# Altium schematic sheet FPGA-Power.SchDoc: ZoM Mod A - FPGA Power
size A4; Organization: Trenz Electronic GmbH / TT; DocumentNumber: 12; Revision: 01; SheetNumber: 12; SheetTotal: 13; Date: 12/16/2014
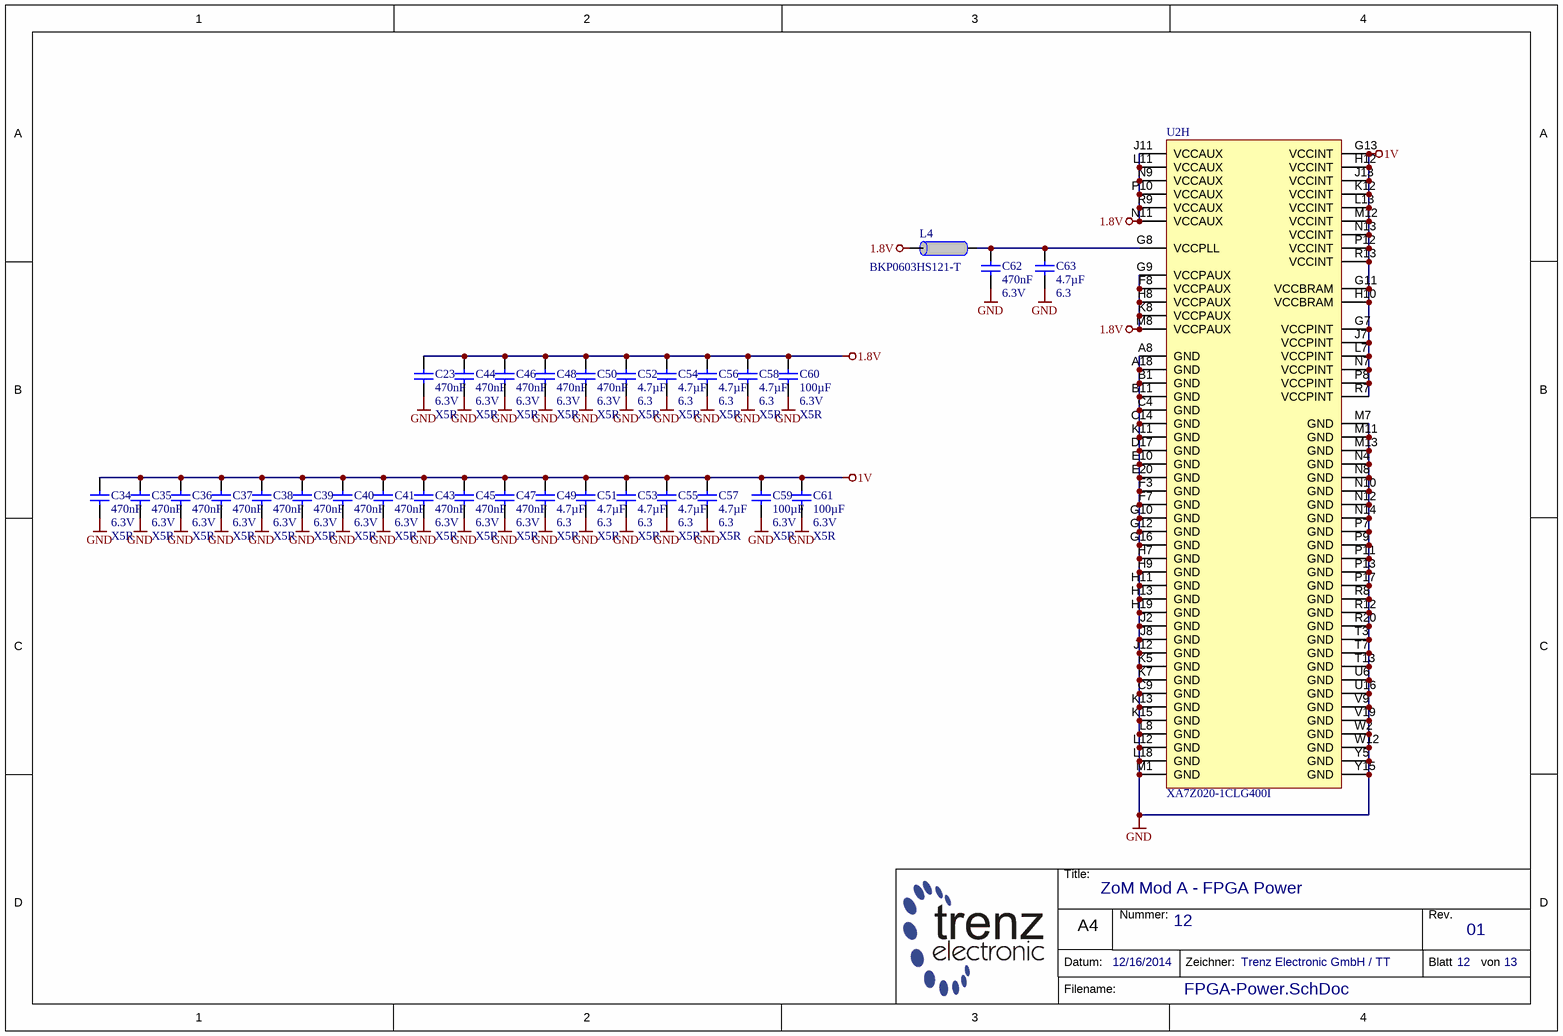
[diagram p0: FPGA-Power.SchDoc]

## Parts
C23  470nF  Voltage: 6.3V  Technology: X5R  [CAPC0603X33N]
C34  470nF  Voltage: 6.3V  Technology: X5R  [CAPC0603X33N]
C35  470nF  Voltage: 6.3V  Technology: X5R  [CAPC0603X33N]
C36  470nF  Voltage: 6.3V  Technology: X5R  [CAPC0603X33N]
C37  470nF  Voltage: 6.3V  Technology: X5R  [CAPC0603X33N]
C38  470nF  Voltage: 6.3V  Technology: X5R  [CAPC0603X33N]
C39  470nF  Voltage: 6.3V  Technology: X5R  [CAPC0603X33N]
C40  470nF  Voltage: 6.3V  Technology: X5R  [CAPC0603X33N]
C41  470nF  Voltage: 6.3V  Technology: X5R  [CAPC0603X33N]
C43  470nF  Voltage: 6.3V  Technology: X5R  [CAPC0603X33N]
C44  470nF  Voltage: 6.3V  Technology: X5R  [CAPC0603X33N]
C45  470nF  Voltage: 6.3V  Technology: X5R  [CAPC0603X33N]
C46  470nF  Voltage: 6.3V  Technology: X5R  [CAPC0603X33N]
C47  470nF  Voltage: 6.3V  Technology: X5R  [CAPC0603X33N]
C48  470nF  Voltage: 6.3V  Technology: X5R  [CAPC0603X33N]
C49  4.7µF  Voltage: 6.3  Technology: X5R  [CAPC1005X60N]
C50  470nF  Voltage: 6.3V  Technology: X5R  [CAPC0603X33N]
C51  4.7µF  Voltage: 6.3  Technology: X5R  [CAPC1005X60N]
C52  4.7µF  Voltage: 6.3  Technology: X5R  [CAPC1005X60N]
C53  4.7µF  Voltage: 6.3  Technology: X5R  [CAPC1005X60N]
C54  4.7µF  Voltage: 6.3  Technology: X5R  [CAPC1005X60N]
C55  4.7µF  Voltage: 6.3  Technology: X5R  [CAPC1005X60N]
C56  4.7µF  Voltage: 6.3  Technology: X5R  [CAPC1005X60N]
C57  4.7µF  Voltage: 6.3  Technology: X5R  [CAPC1005X60N]
C58  4.7µF  Voltage: 6.3  Technology: X5R  [CAPC1005X60N]
C59  100µF  Voltage: 6.3V  Technology: X5R  [CAPC3216X180N]
C60  100µF  Voltage: 6.3V  Technology: X5R  [CAPC3216X180N]
C61  100µF  Voltage: 6.3V  Technology: X5R  [CAPC3216X180N]
C62  470nF  Voltage: 6.3V  [CAPC0603X33N]
C63  4.7µF  Voltage: 6.3  [CAPC1005X60N]
L4  BKP0603HS121-T  [INDC0603X33N]
U2  XA7Z020-1CLG400I  [BGA400C80P20X20_1700X1700X160N]  (part H of 8)

## Nets
1.8V: C23.1 C44.1 C46.1 C48.1 C50.1 C52.1 C54.1 C56.1 C58.1 C60.2 L4.2 U2.F8(VCCPAUX) U2.G9(VCCPAUX) U2.H8(VCCPAUX) U2.J11(VCCAUX) U2.K8(VCCPAUX) U2.L11(VCCAUX) U2.M8(VCCPAUX) U2.N9(VCCAUX) U2.N11(VCCAUX) U2.P10(VCCAUX) U2.R9(VCCAUX)
1V: C34.1 C35.1 C36.1 C37.1 C38.1 C39.1 C40.1 C41.1 C43.1 C45.1 C47.1 C49.1 C51.1 C53.1 C55.1 C57.1 C59.1 C61.1 U2.G7(VCCPINT) U2.G11(VCCBRAM) U2.G13(VCCINT) U2.H10(VCCBRAM) U2.H12(VCCINT) U2.J7(VCCPINT) U2.J13(VCCINT) U2.K12(VCCINT) U2.L7(VCCPINT) U2.L13(VCCINT) U2.M12(VCCINT) U2.N7(VCCPINT) U2.N13(VCCINT) U2.P8(VCCPINT) U2.P12(VCCINT) U2.R7(VCCPINT) U2.R13(VCCINT)
GND: C23.2 C34.2 C35.2 C36.2 C37.2 C38.2 C39.2 C40.2 C41.2 C43.2 C44.2 C45.2 C46.2 C47.2 C48.2 C49.2 C50.2 C51.2 C52.2 C53.2 C54.2 C55.2 C56.2 C57.2 C58.2 C59.2 C60.1 C61.2 C62.2 C63.2 U2.A8(GND) U2.A18(GND) U2.B1(GND) U2.B11(GND) U2.C4(GND) U2.C9(GND) U2.C14(GND) U2.D17(GND) U2.E10(GND) U2.E20(GND) U2.F3(GND) U2.F7(GND) U2.G10(GND) U2.G12(GND) U2.G16(GND) U2.H7(GND) U2.H9(GND) U2.H11(GND) U2.H13(GND) U2.H19(GND) U2.J2(GND) U2.J8(GND) U2.J12(GND) U2.K5(GND) U2.K7(GND) U2.K11(GND) U2.K13(GND) U2.K15(GND) U2.L8(GND) U2.L12(GND) U2.L18(GND) U2.M1(GND) U2.M7(GND) U2.M11(GND) U2.M13(GND) U2.N4(GND) U2.N8(GND) U2.N10(GND) U2.N12(GND) U2.N14(GND) U2.P7(GND) U2.P9(GND) U2.P11(GND) U2.P13(GND) U2.P17(GND) U2.R8(GND) U2.R12(GND) U2.R20(GND) U2.T3(GND) U2.T7(GND) U2.T13(GND) U2.U6(GND) U2.U16(GND) U2.V9(GND) U2.V19(GND) U2.W2(GND) U2.W12(GND) U2.Y5(GND) U2.Y15(GND)
NetC62_1: C62.1 C63.1 L4.1 U2.G8(VCCPLL)

## Notes on the sheet
- Title:
- Nummer:
- Rev.
- Datum:
- A4
- Zeichner:
- Blatt
- von
- Filename:

## Library data of the parts
C23 C34-C41 C43-C48 C50 = 24921: KON 470nF X5R 6.3V SMD; AN: 24921; Value: 470n; Tolerance: 20%; Mixed: SMT; Preferred: Yes; Case: 0603 (0201)
C49 C51-C58 = 24719: KON 4.7µF 6.3V X5R SMD; AN: 24719; Value: 4.7u; Mixed: SMT; Preferred: Yes; Case: 1005 (0402)
C59-C61 = 23116: KON 100µF 6,3V X5R SMD; AN: 23116; Value: 100u; Mixed: SMT; Preferred: Yes; Case: 3216 (1206)
C62 = 24921: KON 470nF X5R 6.3V SMD; AN: 24921; Tolerance: 20%; Mixed: SMT; Value: 470n; Preferred: Yes; Technology: X5R; Case: 0603 (0201)
C63 = 24719: KON 4.7µF 6.3V X5R SMD; AN: 24719; Mixed: SMT; Value: 4.7u; Preferred: Yes; Technology: X5R; Case: 1005 (0402)
L4 = 25393: Ferritdurchführung SMD 0201; AN: 25393; Trenz-Stock: Yes; Mixed: SMT; Case: 0603 (0201); HelpURL: B:\AD\adlib\datasheet\MULTILAYER CHIP BEAD INDUCTORS BK; Preferred: Yes
U2 = 25981: AN: 25981; Mixed: SMT; Trenz-Stock: Yes; Case: CLG400; HelpURL: B:\AD\adlib\datasheet\XC7